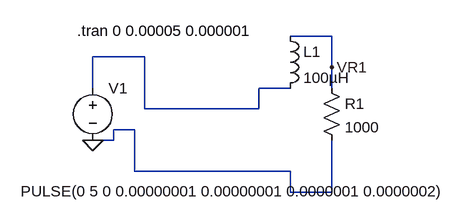
[diagram p0: schematic Draft9.asc]
Draft9.asc, the LTspice schematic file:
Version 4
SHEET 1 880 680
WIRE 624 176 560 176
WIRE 336 208 256 208
WIRE 624 224 624 176
WIRE 256 256 256 208
WIRE 560 256 512 256
WIRE 624 256 624 224
WIRE 336 288 336 208
WIRE 512 288 512 256
WIRE 512 288 336 288
WIRE 320 320 288 320
WIRE 288 336 288 320
WIRE 288 336 256 336
WIRE 320 384 320 320
WIRE 560 384 320 384
WIRE 560 416 560 384
WIRE 624 416 624 336
WIRE 624 416 560 416
FLAG 256 336 0
FLAG 624 224 VR1
SYMBOL voltage 256 240 R0
WINDOW 3 -111 175 Left 2
SYMATTR Value PULSE(0 5 0 0.00000001 0.00000001 0.0000001 0.0000002)
SYMATTR InstName V1
SYMBOL ind 544 160 R0
SYMATTR InstName L1
SYMATTR Value 100µH
SYMBOL res 608 240 R0
SYMATTR InstName R1
SYMATTR Value 1000
TEXT 232 168 Left 2 !.tran 0 0.00005 0.000001

The netlist it stands for:
* Draft9.asc
V1 N001 0 PULSE(0 5 0 0.00000001 0.00000001 0.0000001 0.0000002)
L1 VR1 N001 100µH
R1 VR1 0 1000
.tran 0 0.00005 0.000001
.backanno
.end